# Altium schematic sheet STM.SchDoc
size A4; SheetNumber: 4; SheetTotal: 9
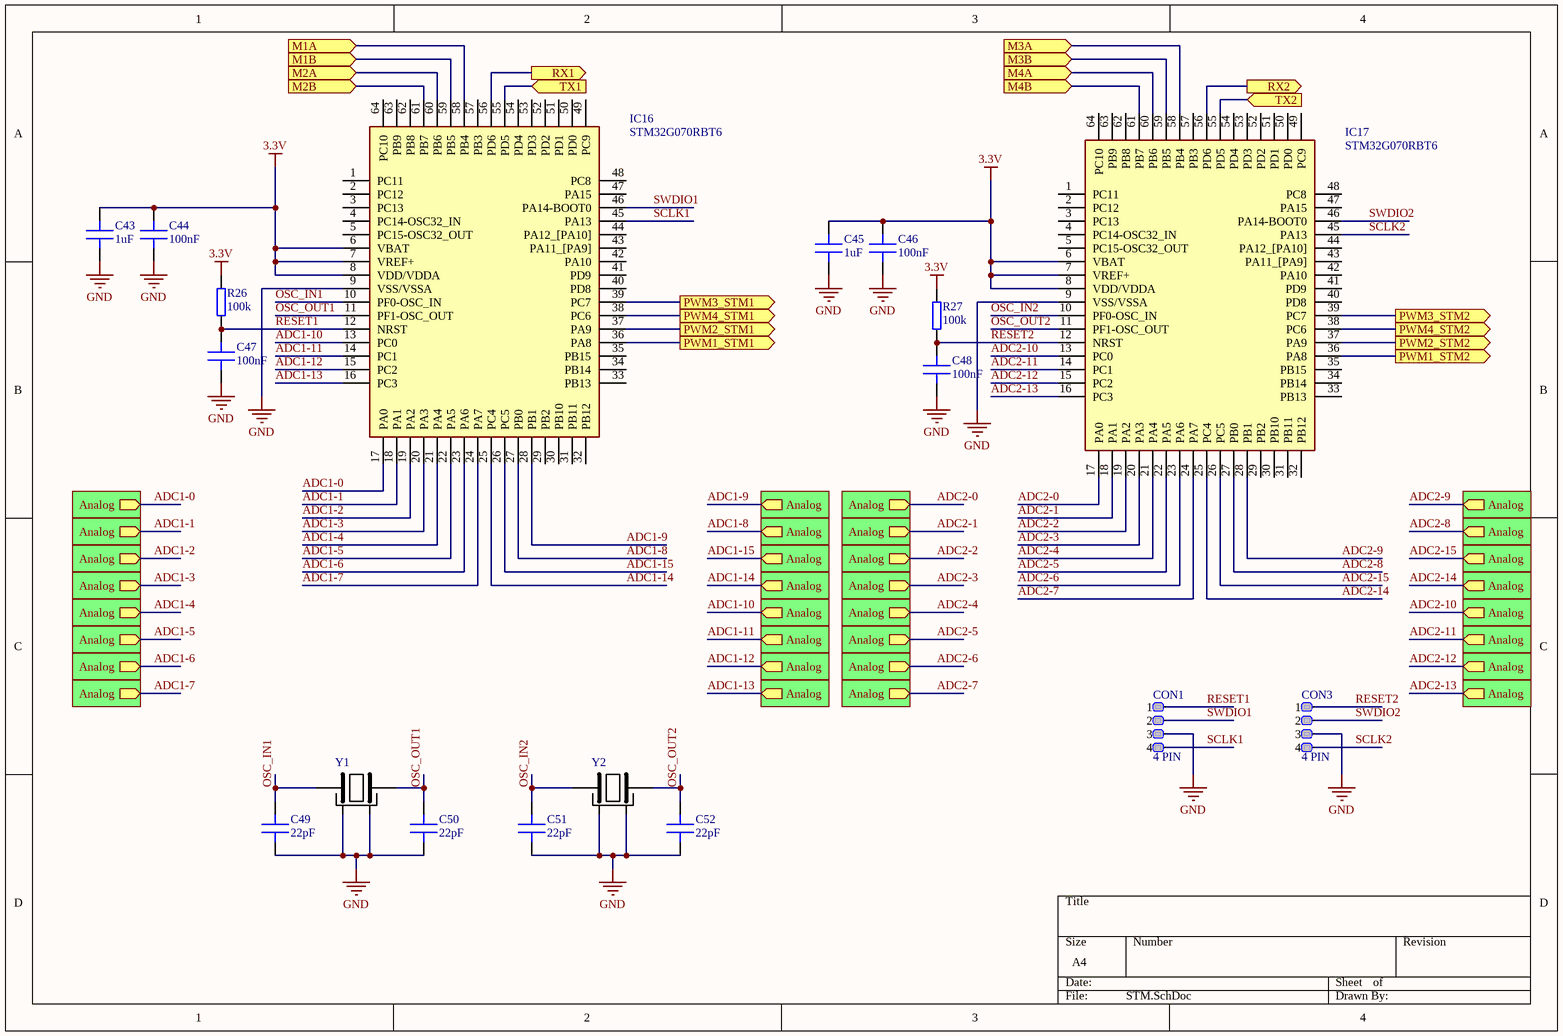
[diagram p0: STM.SchDoc]

## Parts
C43  1uF  [C 0402]
C44  100nF  [C 0402]
C45  1uF  [C 0402]
C46  100nF  [C 0402]
C47  100nF  [C 0402]
C48  100nF  [C 0402]
C49  22pF  [C 0402]
C50  22pF  [C 0402]
C51  22pF  [C 0402]
C52  22pF  [C 0402]
CON1  4 PIN  [BM04B-SRSS-TB]
CON3  4 PIN  [BM04B-SRSS-TB]
IC16  STM32G070RBT6  [QFP50P1200X1200X160-64N]
IC17  STM32G070RBT6  [QFP50P1200X1200X160-64N]
R26  100k  [R 0402]
R27  100k  [R 0402]
Y1  MCSJK-7U-16.00-12-30-80-B-30  [MCSJK7U1600123080B30]  (value not drawn)
Y2  MCSJK-7U-16.00-12-30-80-B-30  [MCSJK7U1600123080B30]  (value not drawn)

## Sub-sheets
U_Sensors = Sensors.SchDoc: Analog (out)
U_Sensors = Sensors.SchDoc: Analog (out)
U_Sensors = Sensors.SchDoc: Analog (out)
U_Sensors = Sensors.SchDoc: Analog (out)
U_Sensors = Sensors.SchDoc: Analog (out)
U_Sensors = Sensors.SchDoc: Analog (out)
U_Sensors = Sensors.SchDoc: Analog (out)
U_Sensors = Sensors.SchDoc: Analog (out)
U_Sensors = Sensors.SchDoc: Analog (out)
U_Sensors = Sensors.SchDoc: Analog (out)
U_Sensors = Sensors.SchDoc: Analog (out)
U_Sensors = Sensors.SchDoc: Analog (out)
U_Sensors = Sensors.SchDoc: Analog (out)
U_Sensors = Sensors.SchDoc: Analog (out)
U_Sensors = Sensors.SchDoc: Analog (out)
U_Sensors = Sensors.SchDoc: Analog (out)
U_Sensors = Sensors.SchDoc: Analog (out)
U_Sensors = Sensors.SchDoc: Analog (out)
U_Sensors = Sensors.SchDoc: Analog (out)
U_Sensors = Sensors.SchDoc: Analog (out)
U_Sensors = Sensors.SchDoc: Analog (out)
U_Sensors = Sensors.SchDoc: Analog (out)
U_Sensors = Sensors.SchDoc: Analog (out)
U_Sensors = Sensors.SchDoc: Analog (out)
U_Sensors = Sensors.SchDoc: Analog (out)
U_Sensors = Sensors.SchDoc: Analog (out)
U_Sensors = Sensors.SchDoc: Analog (out)
U_Sensors = Sensors.SchDoc: Analog (out)
U_Sensors = Sensors.SchDoc: Analog (out)
U_Sensors = Sensors.SchDoc: Analog (out)
U_Sensors = Sensors.SchDoc: Analog (out)
U_Sensors = Sensors.SchDoc: Analog (out)

## Ports
M1A (in), M1B (in), M2A (in), M2B (in), M3A (in), M3B (in), M4A (in), M4B (in), PWM1_STM1 (out), PWM1_STM2 (out), PWM2_STM1 (out), PWM2_STM2 (out), PWM3_STM1 (out), PWM3_STM2 (out), PWM4_STM1 (out), PWM4_STM2 (out), RX1 (out), RX2 (out), TX1 (in), TX2 (in)

## Nets
3.3V: C43.1 C44.1 C45.1 C46.1 IC16.6(VBAT) IC16.7(VREF+) IC16.8(VDD/VDDA) IC17.6(VBAT) IC17.7(VREF+) IC17.8(VDD/VDDA) R26.2 R27.2
GND: C43.2 C44.2 C45.2 C46.2 C47.2 C48.2 C49.2 C50.2 C51.2 C52.2 CON1.3 CON3.3 IC16.9(VSS/VSSA) IC17.9(VSS/VSSA) Y1.2(GND_1) Y1.4(GND_2) Y2.2(GND_1) Y2.4(GND_2)
ADC1-0: IC16.17(PA0) ; sheet U_Sensors/Analog
ADC1-1: IC16.18(PA1) ; sheet U_Sensors/Analog
ADC1-2: IC16.19(PA2) ; sheet U_Sensors/Analog
ADC1-3: IC16.20(PA3) ; sheet U_Sensors/Analog
ADC1-4: IC16.21(PA4) ; sheet U_Sensors/Analog
ADC1-5: IC16.22(PA5) ; sheet U_Sensors/Analog
ADC1-6: IC16.23(PA6) ; sheet U_Sensors/Analog
ADC1-7: IC16.24(PA7) ; sheet U_Sensors/Analog
ADC1-8: IC16.27(PB0) ; sheet U_Sensors/Analog
ADC1-9: IC16.28(PB1) ; sheet U_Sensors/Analog
ADC1-10: IC16.13(PC0) ; sheet U_Sensors/Analog
ADC1-11: IC16.14(PC1) ; sheet U_Sensors/Analog
ADC1-12: IC16.15(PC2) ; sheet U_Sensors/Analog
ADC1-13: IC16.16(PC3) ; sheet U_Sensors/Analog
ADC1-14: IC16.25(PC4) ; sheet U_Sensors/Analog
ADC1-15: IC16.26(PC5) ; sheet U_Sensors/Analog
ADC2-0: IC17.17(PA0) ; sheet U_Sensors/Analog
ADC2-1: IC17.18(PA1) ; sheet U_Sensors/Analog
ADC2-2: IC17.19(PA2) ; sheet U_Sensors/Analog
ADC2-3: IC17.20(PA3) ; sheet U_Sensors/Analog
ADC2-4: IC17.21(PA4) ; sheet U_Sensors/Analog
ADC2-5: IC17.22(PA5) ; sheet U_Sensors/Analog
ADC2-6: IC17.23(PA6) ; sheet U_Sensors/Analog
ADC2-7: IC17.24(PA7) ; sheet U_Sensors/Analog
ADC2-8: IC17.27(PB0) ; sheet U_Sensors/Analog
ADC2-9: IC17.28(PB1) ; sheet U_Sensors/Analog
ADC2-10: IC17.13(PC0) ; sheet U_Sensors/Analog
ADC2-11: IC17.14(PC1) ; sheet U_Sensors/Analog
ADC2-12: IC17.15(PC2) ; sheet U_Sensors/Analog
ADC2-13: IC17.16(PC3) ; sheet U_Sensors/Analog
ADC2-14: IC17.25(PC4) ; sheet U_Sensors/Analog
ADC2-15: IC17.26(PC5) ; sheet U_Sensors/Analog
M1A: IC16.58(PB4) ; port M1A
M1B: IC16.59(PB5) ; port M1B
M2A: IC16.60(PB6) ; port M2A
M2B: IC16.61(PB7) ; port M2B
M3A: IC17.58(PB4) ; port M3A
M3B: IC17.59(PB5) ; port M3B
M4A: IC17.60(PB6) ; port M4A
M4B: IC17.61(PB7) ; port M4B
OSC_IN1: C49.1 IC16.10(PF0-OSC_IN) Y1.1(CRYSTAL_1)
OSC_IN2: C51.1 IC17.10(PF0-OSC_IN) Y2.1(CRYSTAL_1)
OSC_OUT1: C50.1 IC16.11(PF1-OSC_OUT) Y1.3(CRYSTAL_2)
OSC_OUT2: C52.1 IC17.11(PF1-OSC_OUT) Y2.3(CRYSTAL_2)
PWM1_STM1: IC16.36(PA8) ; port PWM1_STM1
PWM1_STM2: IC17.36(PA8) ; port PWM1_STM2
PWM2_STM1: IC16.37(PA9) ; port PWM2_STM1
PWM2_STM2: IC17.37(PA9) ; port PWM2_STM2
PWM3_STM1: IC16.39(PC7) ; port PWM3_STM1
PWM3_STM2: IC17.39(PC7) ; port PWM3_STM2
PWM4_STM1: IC16.38(PC6) ; port PWM4_STM1
PWM4_STM2: IC17.38(PC6) ; port PWM4_STM2
RESET1: C47.1 CON1.1 IC16.12(NRST) R26.1
RESET2: C48.1 CON3.1 IC17.12(NRST) R27.1
RX1: IC16.56(PD6) ; port RX1
RX2: IC17.56(PD6) ; port RX2
SCLK1: CON1.4 IC16.45(PA13)
SCLK2: CON3.4 IC17.45(PA13)
SWDIO1: CON1.2 IC16.46(PA14-BOOT0)
SWDIO2: CON3.2 IC17.46(PA14-BOOT0)
TX1: IC16.55(PD5) ; port TX1
TX2: IC17.55(PD5) ; port TX2

Not connected (* = marked no-connect by the designer): IC16 1(PC11) 2(PC12) 3(PC13) 4(PC14-OSC32_IN) 5(PC15-OSC32_OUT) 29(PB2) 30(PB10) 31(PB11) 32(PB12) 33(PB13) 34(PB14) 35(PB15) 40(PD8) 41(PD9) 42(PA10) 43(PA11_[PA9]) 44(PA12_[PA10]) 47(PA15) 48(PC8) 49(PC9) 50(PD0) 51(PD1) 52(PD2) 53(PD3) 54(PD4) 57(PB3) 62(PB8) 63(PB9) 64(PC10); IC17 1(PC11) 2(PC12) 3(PC13) 4(PC14-OSC32_IN) 5(PC15-OSC32_OUT) 29(PB2) 30(PB10) 31(PB11) 32(PB12) 33(PB13) 34(PB14) 35(PB15) 40(PD8) 41(PD9) 42(PA10) 43(PA11_[PA9]) 44(PA12_[PA10]) 47(PA15) 48(PC8) 49(PC9) 50(PD0) 51(PD1) 52(PD2) 53(PD3) 54(PD4) 57(PB3) 62(PB8) 63(PB9) 64(PC10)

## Library data of the parts
C43-C52 = Capacitor: MLCC Capacitor
IC16 IC17 = STM32G070RBT6: Integrated Circuit; Manufacturer_Name: STMicroelectronics; Datasheet Link: https://componentsearchengine.com/Datasheets/1/STM32G070RBT6.pdf; Height: 1.6mm; Manufacturer_Part_Number: STM32G070RBT6; Mouser Part Number: 511-STM32G070RBT6; Mouser Price/Stock: https://www.mouser.co.uk/ProductDetail/STMicroelectronics/STM32G070RBT6?qs=l7cgNqFNU1g2MF3TqxTHUQ%3D%3D; Arrow Part Number: STM32G070RBT6; Arrow Price/Stock: https://www.arrow.com/en/products/stm32g070rbt6/stmicroelectronics?utm_currency=USD&region=nac
R26 R27 = Resistor: General pourpouse resistor
Y1 Y2 = MCSJK-7U-16.00-12-30-80-B-30: Crystal or Oscillator; Manufacturer_Name: MULTICOMP; Datasheet Link: https://www.farnell.com/datasheets/2864166.pdf; Height: 0.8mm; Manufacturer_Part_Number: MCSJK-7U-16.00-12-30-80-B-30